# Altium schematic sheet MCU.SchDoc
size A; SheetNumber: 1; SheetTotal: 2
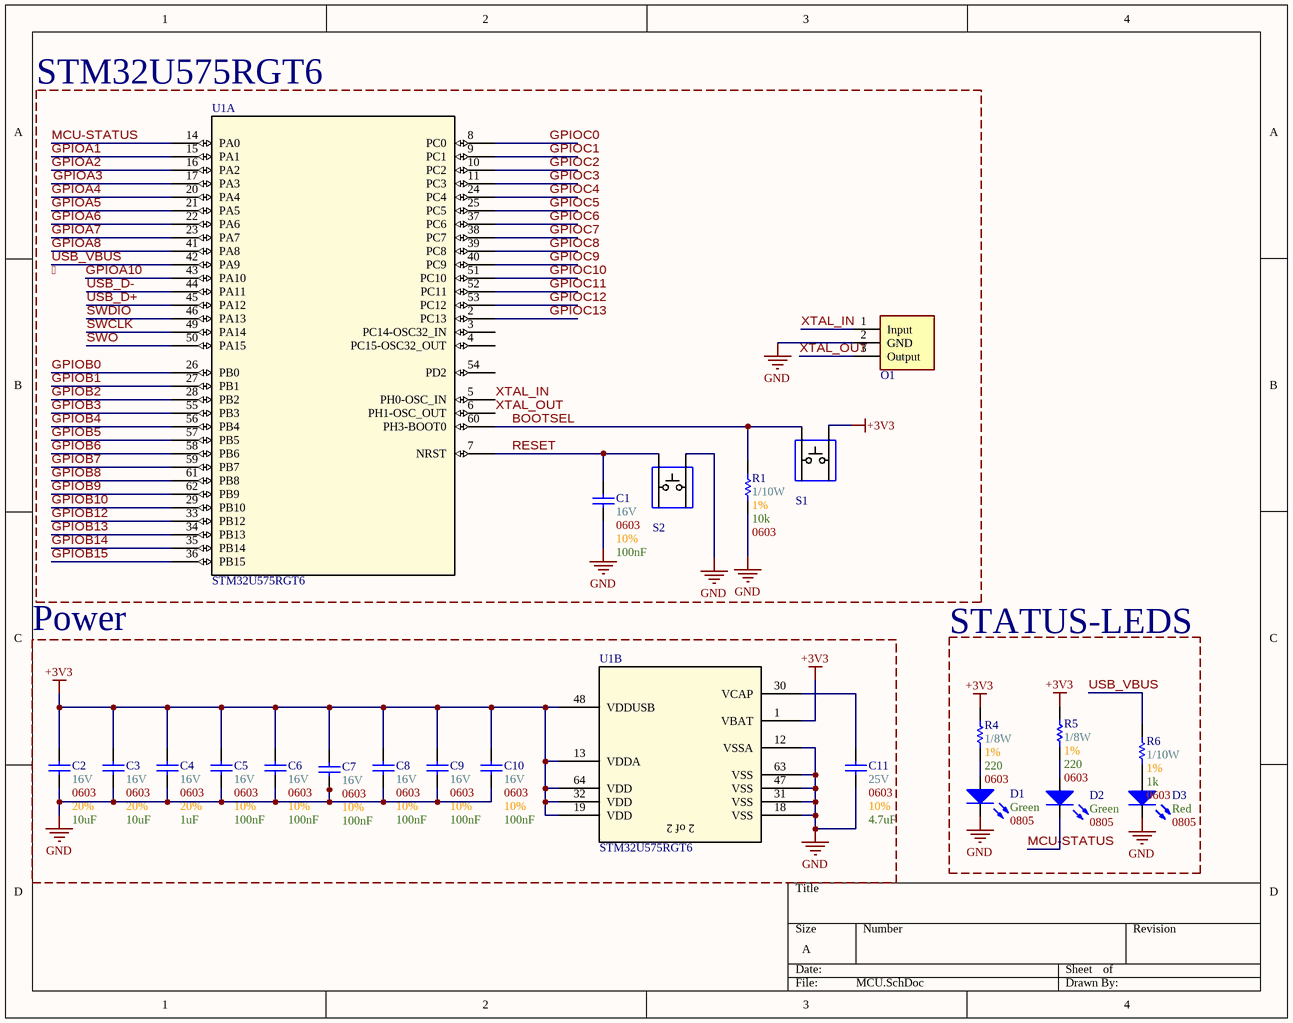
[diagram p0: MCU.SchDoc]

## Parts
C1  Max Voltage: 16V  Size Package: 0603  Tolerance: 10%  Capacitance: 100nF  [[Cap] SMD 0603]  (hidden comment: [Cap] 0603 0.1uF 10% 16V)
C2  Max Voltage: 16V  Size Package: 0603  Tolerance: 20%  Capacitance: 10uF  [[Cap] SMD 0603]  (hidden comment: [Cap] 0603 10uF 20% 16V)
C3  Max Voltage: 16V  Size Package: 0603  Tolerance: 20%  Capacitance: 10uF  [[Cap] SMD 0603]  (hidden comment: [Cap] 0603 10uF 20% 16V)
C4  Max Voltage: 16V  Size Package: 0603  Tolerance: 20%  Capacitance: 1uF  [[Cap] SMD 0603]  (hidden comment: [Cap] 0603 10uF 20% 16V)
C5  Max Voltage: 16V  Size Package: 0603  Tolerance: 10%  Capacitance: 100nF  [[Cap] SMD 0603]  (hidden comment: [Cap] 0603 0.1uF 10% 16V)
C6  Max Voltage: 16V  Size Package: 0603  Tolerance: 10%  Capacitance: 100nF  [[Cap] SMD 0603]  (hidden comment: [Cap] 0603 0.1uF 10% 16V)
C7  Max Voltage: 16V  Size Package: 0603  Tolerance: 10%  Capacitance: 100nF  [[Cap] SMD 0603]  (hidden comment: [Cap] 0603 0.1uF 10% 16V)
C8  Max Voltage: 16V  Size Package: 0603  Tolerance: 10%  Capacitance: 100nF  [[Cap] SMD 0603]  (hidden comment: [Cap] 0603 0.1uF 10% 16V)
C9  Max Voltage: 16V  Size Package: 0603  Tolerance: 10%  Capacitance: 100nF  [[Cap] SMD 0603]  (hidden comment: [Cap] 0603 0.1uF 10% 16V)
C10  Max Voltage: 16V  Size Package: 0603  Tolerance: 10%  Capacitance: 100nF  [[Cap] SMD 0603]  (hidden comment: [Cap] 0603 0.1uF 10% 16V)
C11  Max Voltage: 25V  Size Package: 0603  Tolerance: 10%  Capacitance: 4.7uF  [[Cap] SMD 0603]  (hidden comment: [Cap] 0603 4.7uF 10% 25V)
D1  Color: Green  Size Package: 0805  [[LED] SMD 0805]  (hidden comment: [LED] SMD 0805 Green)
D2  Color: Green  Size Package: 0805  [[LED] SMD 0805]  (hidden comment: [LED] SMD 0805 Green)
D3  Color: Red  Size Package: 0805  [[LED] SMD 0805]  (hidden comment: [LED] SMD 0805 Red)
O1  XOSC 12MHz  [[Resonator] SMD 12MHz]  (value not drawn)
R1  Wattage: 1/10W  Tolerance: 1%  Resistance: 10k  Size Package: 0603  [[Res] SMD 0603]  (hidden comment: [10k] SMD 0603 1% 1/8W)
R4  Wattage: 1/8W  Tolerance: 1%  Resistance: 220  Size Package: 0603  [[Res] SMD 0603]  (hidden comment: [220] SMD 0603 1% 1/10W)
R5  Wattage: 1/8W  Tolerance: 1%  Resistance: 220  Size Package: 0603  [[Res] SMD 0603]  (hidden comment: [220] SMD 0603 1% 1/10W)
R6  Wattage: 1/10W  Tolerance: 1%  Resistance: 1k  Size Package: 0603  [[Res] SMD 0603]  (hidden comment: [1k] SMD 0603 1% 1/10W)
S1  Standard pushbutton  [[SPST] Pushbutton]  (value not drawn)
S2  Standard pushbutton  [[SPST] Pushbutton]  (value not drawn)
U1  STM32U575RGT6  [LQFP64-10x10mm_STM]  (parts A,B of 2)

## Blocks framed on the sheet
STM32U575RGT6: C1 O1 R1 S1 S2 U1
Power: C2-C11 U1
STATUS-LEDS: D1-D3 R4-R6

## Nets
+3V3: C2.2 C3.2 C4.2 C5.2 C6.2 C7.2 C8.2 C9.2 C10.2 R4.2 R5.2 S1.1 U1.1(VBAT) U1.13(VDDA) U1.19(VDD) U1.32(VDD) U1.48(VDDUSB) U1.64(VDD)
GND: C1.1 C2.1 C3.1 C4.1 C5.1 C6.1 C7.1 C8.1 C9.1 C10.1 C11.1 D1.2(Cathode) D3.2(Cathode) O1.2(GND) R1.1 S2.1 U1.12(VSSA) U1.18(VSS) U1.31(VSS) U1.47(VSS) U1.63(VSS)
BOOTSEL: R1.2 S1.2 U1.60(PH3-BOOT0)
GPIOA1: U1.15(PA1)
GPIOA2: U1.16(PA2)
GPIOA3: U1.17(PA3)
GPIOA4: U1.20(PA4)
GPIOA5: U1.21(PA5)
GPIOA6: U1.22(PA6)
GPIOA7: U1.23(PA7)
GPIOA8: U1.41(PA8)
GPIOA10: U1.43(PA10)
GPIOB0: U1.26(PB0)
GPIOB1: U1.27(PB1)
GPIOB2: U1.28(PB2)
GPIOB3: U1.55(PB3)
GPIOB4: U1.56(PB4)
GPIOB5: U1.57(PB5)
GPIOB6: U1.58(PB6)
GPIOB7: U1.59(PB7)
GPIOB8: U1.61(PB8)
GPIOB9: U1.62(PB9)
GPIOB10: U1.29(PB10)
GPIOB12: U1.33(PB12)
GPIOB13: U1.34(PB13)
GPIOB14: U1.35(PB14)
GPIOB15: U1.36(PB15)
GPIOC0: U1.8(PC0)
GPIOC1: U1.9(PC1)
GPIOC2: U1.10(PC2)
GPIOC3: U1.11(PC3)
GPIOC4: U1.24(PC4)
GPIOC5: U1.25(PC5)
GPIOC6: U1.37(PC6)
GPIOC7: U1.38(PC7)
GPIOC8: U1.39(PC8)
GPIOC9: U1.40(PC9)
GPIOC10: U1.51(PC10)
GPIOC11: U1.52(PC11)
GPIOC12: U1.53(PC12)
GPIOC13: U1.2(PC13)
MCU-STATUS: D2.2(Cathode) U1.14(PA0)
RESET: C1.2 S2.2 U1.7(NRST)
SWCLK: U1.49(PA14)
SWDIO: U1.46(PA13)
SWO: U1.50(PA15)
USB_D+: U1.45(PA12)
USB_D-: U1.44(PA11)
USB_VBUS: R6.2 U1.42(PA9)
XTAL_IN: O1.1(Input) U1.5(PH0-OSC_IN)
XTAL_OUT: O1.3(Output) U1.6(PH1-OSC_OUT)
NetC11_2: C11.2 U1.30(VCAP)
NetD1_1: D1.1(Anode) R4.1
NetD2_1: D2.1(Anode) R5.1
NetD3_1: D3.1(Anode) R6.1

Not connected (* = marked no-connect by the designer): U1 3(PC14-OSC32_IN) 4(PC15-OSC32_OUT) 54(PD2)

## Notes on the sheet
- Labels drawn without touching a wire or pin: 
- (in symbol CMP-031-00064-2, part B) 2 of 2

## Library data of the parts
C1 C5-C10 = [Cap] 0603 0.1uF 10% 16V: CC0603KRX7R7BB104; Supplier 1: DigiKey; Supplier Part Number 1: 311-1088-6-ND
C2-C4 = [Cap] 0603 10uF 20% 16V: GRM188C81C106MA73D; Supplier 1: DigiKey; Supplier Part Number 1: 490-7198-1-ND
C11 = [Cap] 0603 4.7uF 10% 25V: GRM188R61E475KE11D; Supplier 1: DigiKey; Supplier Part Number 1: 490-7203-6-ND
D1 D2 = [LED] SMD 0805 Green: LG R971-KN-1-0-20-R18; Supplier 1: DigiKey; Supplier Part Number 1: 475-LGR971-KN-1CT-ND
D3 = [LED] SMD 0805 Red: LS R976-NR-1-0-20-R18; Supplier 1: DigiKey; Supplier Part Number 1: 475-LSR976-NR-1CT-ND
O1 = [Resonator] SMD 12MHz: CSTNE12M0GH5L000R0; Supplier 1: DigiKey; Supplier Part Number 1: 490-17947-1-ND
R1 = [10k] SMD 0603 1% 1/8W: RMCF0603FT10K0; Supplier 1: DigiKey; Supplier Part Number 1: RMCF0603FT10K0DKR-ND
R4 R5 = [220] SMD 0603 1% 1/10W: CRGCQ0805F220R; Supplier 1: DigiKey; Supplier Part Number 1: A129741CT-ND
R6 = [1k] SMD 0603 1% 1/10W: RMCF0603FT1K00; Supplier 1: DigiKey; Supplier Part Number 1: RMCF0603FT1K00DKR-ND
S1 S2 = [SPST] Pushbutton: Supplier 1: DigiKey; Supplier Part Number 1: 450-1650-ND
U1 = CMP-031-00064-2: Ultra-low-power with FPU Arm Cortex-M33 MCU with TrustZone, 160 MHz with 1 Mbyte of Flash memory; Manufacturer_Name: STMicroelectronics; Source: STM32U575RGT6.SchLib; Component Type: Standard; Manufacturer_Part_Number: STM32U575RGT6; Pins: 64; Design Item ID: STM32U575RGT6; RefDes: RefDes; Type: Type; Datasheet: https://www.st.com/resource/en/datasheet/stm32u575ag.pdf; Copyright: Copyright (C) 2025 Ultra Librarian. All rights reserved.